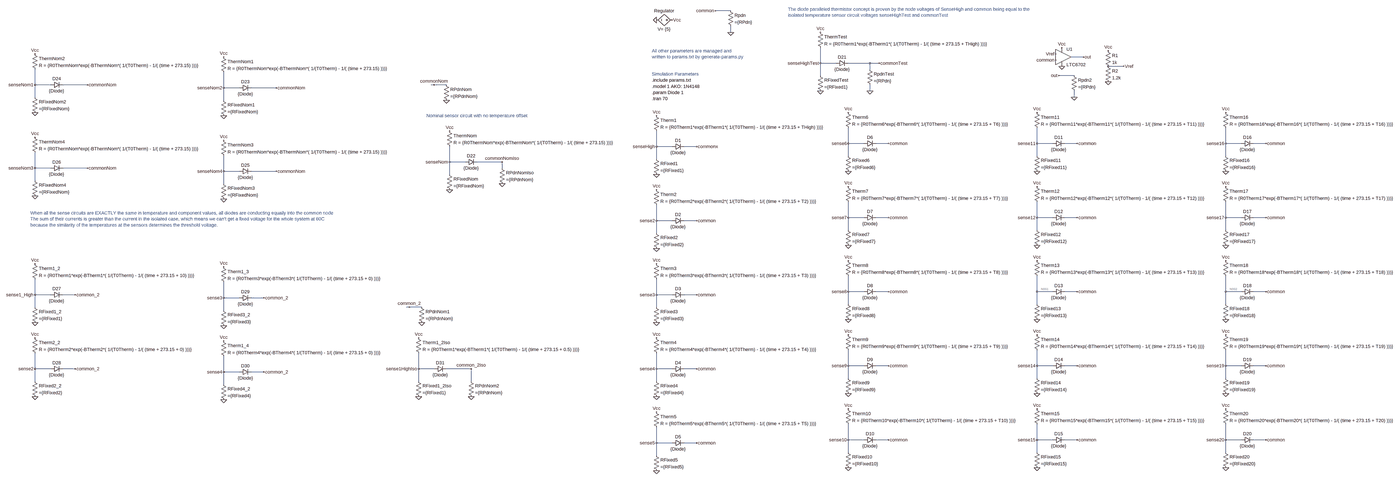
[diagram p0: schematic thermistor.asc, whole sheet]
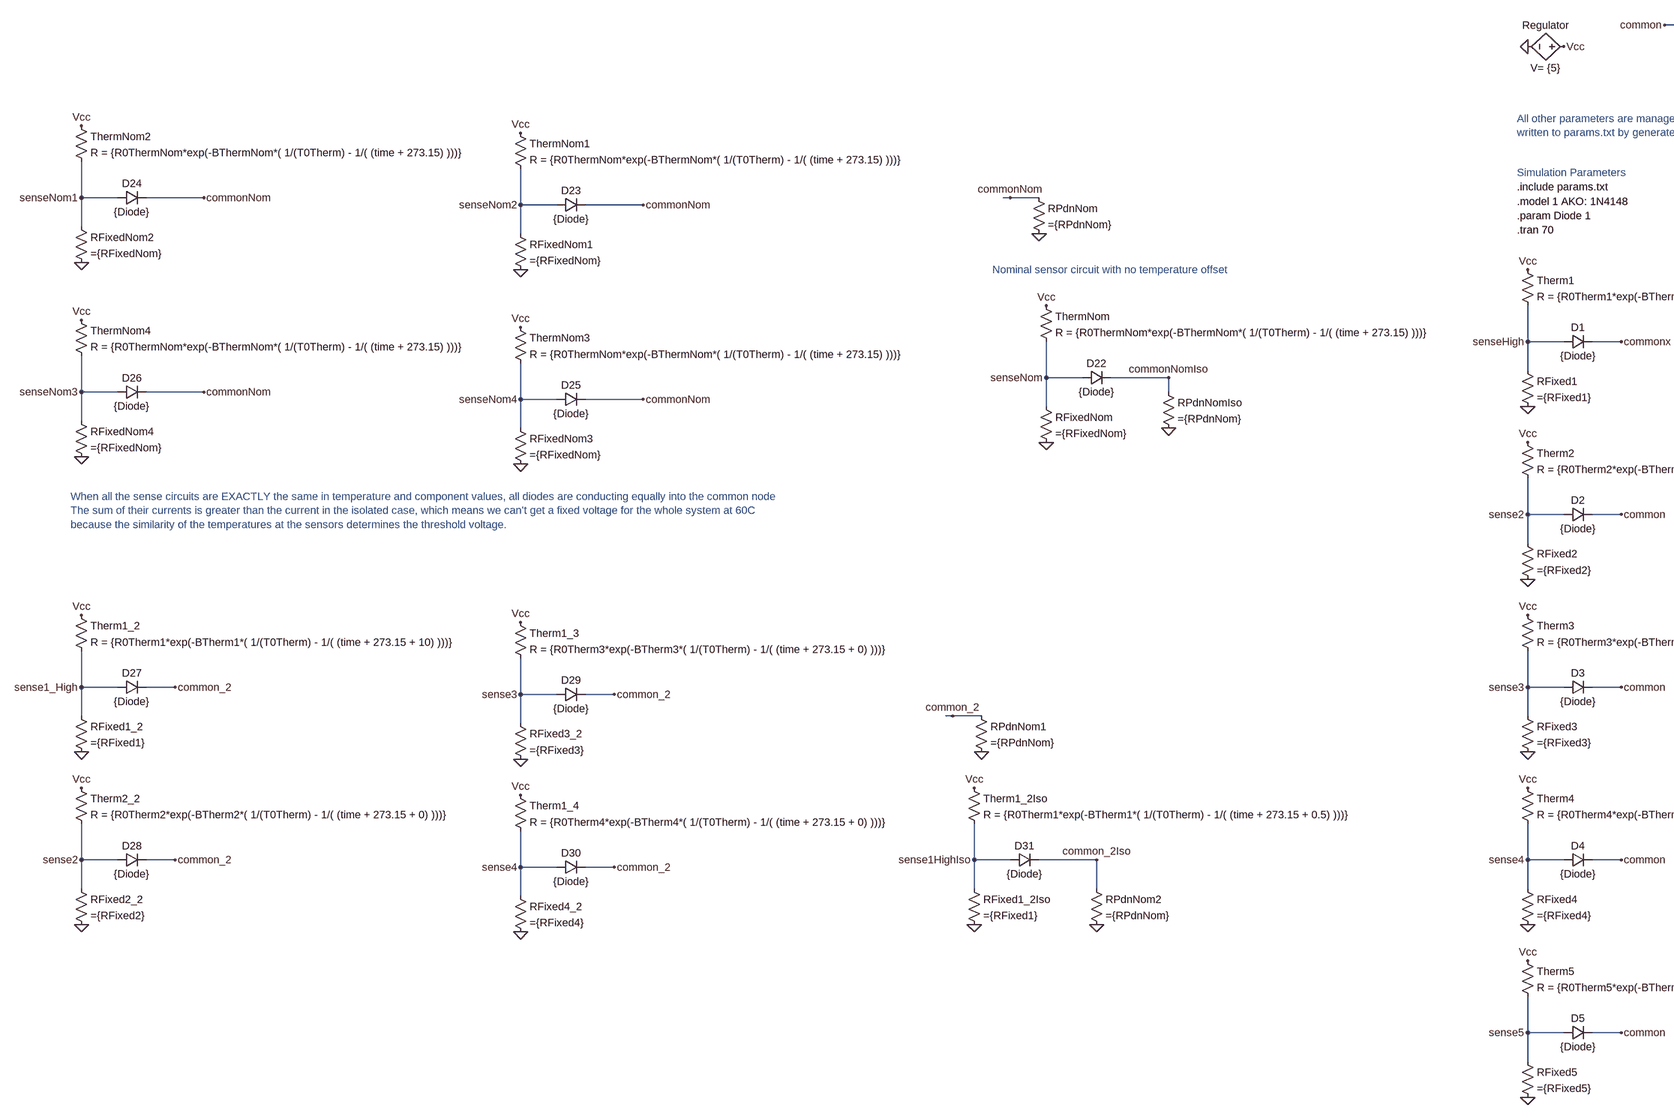
[diagram p1: schematic thermistor.asc, part, row 1 of 1, column 1 of 2]
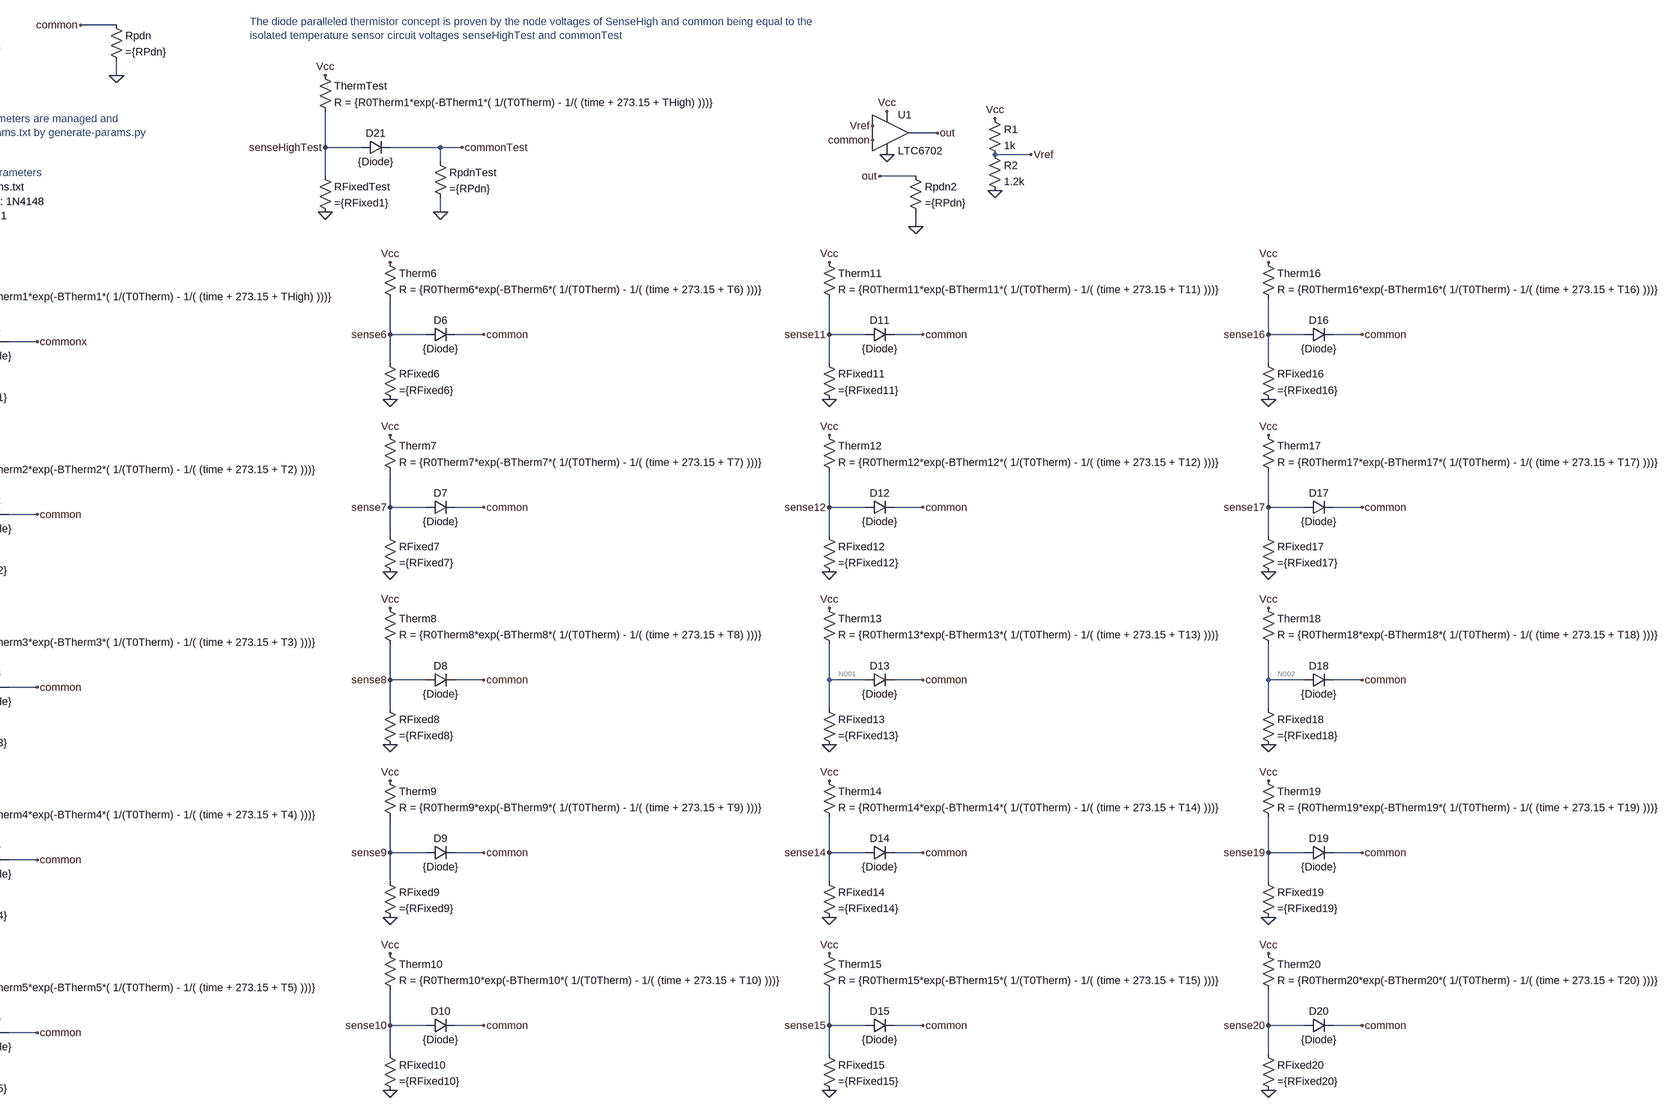
[diagram p2: schematic thermistor.asc, part, row 1 of 1, column 2 of 2]
thermistor.asc, the LTspice schematic file:
Version 4
SHEET 1 4100 2260
WIRE 560 -528 480 -528
WIRE 560 -416 560 -448
WIRE 2384 -288 2320 -288
WIRE 1024 -256 1024 -336
WIRE 1104 -256 1024 -256
WIRE 1280 -256 1168 -256
WIRE 1328 -256 1280 -256
WIRE 2592 -240 2512 -240
WIRE 1280 -224 1280 -256
WIRE 1024 -192 1024 -256
WIRE 2336 -192 2256 -192
WIRE -5088 -144 -5088 -224
WIRE -5008 -144 -5088 -144
WIRE -4816 -144 -4944 -144
WIRE -3024 -144 -3040 -144
WIRE -2960 -144 -3024 -144
WIRE -4112 -128 -4112 -208
WIRE -4032 -128 -4112 -128
WIRE -3840 -128 -3968 -128
WIRE 1280 -112 1280 -144
WIRE -5088 -80 -5088 -144
WIRE 2336 -80 2336 -112
WIRE -4112 -64 -4112 -128
WIRE 1168 160 1168 80
WIRE 1248 160 1168 160
WIRE 1376 160 1312 160
WIRE 2144 160 2144 80
WIRE 2224 160 2144 160
WIRE 2352 160 2288 160
WIRE 3120 160 3120 80
WIRE 3200 160 3120 160
WIRE 3328 160 3264 160
WIRE 176 176 176 96
WIRE 256 176 176 176
WIRE 384 176 320 176
WIRE 1168 224 1168 160
WIRE 2144 224 2144 160
WIRE 3120 224 3120 160
WIRE 176 240 176 176
WIRE -2944 256 -2944 176
WIRE -2864 256 -2944 256
WIRE -2672 256 -2800 256
WIRE -5088 288 -5088 208
WIRE -5008 288 -5088 288
WIRE -4816 288 -4944 288
WIRE -2672 288 -2672 256
WIRE -4112 304 -4112 224
WIRE -4032 304 -4112 304
WIRE -3840 304 -3968 304
WIRE -2944 320 -2944 256
WIRE -5088 352 -5088 288
WIRE -4112 368 -4112 304
WIRE 1168 544 1168 464
WIRE 1248 544 1168 544
WIRE 1376 544 1312 544
WIRE 2144 544 2144 464
WIRE 2224 544 2144 544
WIRE 2352 544 2288 544
WIRE 3120 544 3120 464
WIRE 3200 544 3120 544
WIRE 3328 544 3264 544
WIRE 176 560 176 480
WIRE 256 560 176 560
WIRE 384 560 320 560
WIRE 1168 608 1168 544
WIRE 2144 608 2144 544
WIRE 3120 608 3120 544
WIRE 176 624 176 560
WIRE 1168 928 1168 848
WIRE 1248 928 1168 928
WIRE 1376 928 1312 928
WIRE 2144 928 2144 848
WIRE 2224 928 2144 928
WIRE 2352 928 2288 928
WIRE 3120 928 3120 848
WIRE 3200 928 3120 928
WIRE 3328 928 3264 928
WIRE -5088 944 -5088 864
WIRE -5008 944 -5088 944
WIRE -4880 944 -4944 944
WIRE 176 944 176 864
WIRE 256 944 176 944
WIRE 384 944 320 944
WIRE -4112 960 -4112 880
WIRE -4032 960 -4112 960
WIRE -3904 960 -3968 960
WIRE 1168 992 1168 928
WIRE 2144 992 2144 928
WIRE 3120 992 3120 928
WIRE -5088 1008 -5088 944
WIRE -3152 1008 -3168 1008
WIRE -3088 1008 -3152 1008
WIRE 176 1008 176 944
WIRE -4112 1024 -4112 960
WIRE 1168 1312 1168 1232
WIRE 1248 1312 1168 1312
WIRE 1376 1312 1312 1312
WIRE 2144 1312 2144 1232
WIRE 2224 1312 2144 1312
WIRE 2352 1312 2288 1312
WIRE 3120 1312 3120 1232
WIRE 3200 1312 3120 1312
WIRE 3328 1312 3264 1312
WIRE -5088 1328 -5088 1248
WIRE -5008 1328 -5088 1328
WIRE -4880 1328 -4944 1328
WIRE -3104 1328 -3104 1248
WIRE -3024 1328 -3104 1328
WIRE -2832 1328 -2960 1328
WIRE 176 1328 176 1248
WIRE 256 1328 176 1328
WIRE 384 1328 320 1328
WIRE -4112 1344 -4112 1264
WIRE -4032 1344 -4112 1344
WIRE -3904 1344 -3968 1344
WIRE 1168 1376 1168 1312
WIRE 2144 1376 2144 1312
WIRE 3120 1376 3120 1312
WIRE -5088 1392 -5088 1328
WIRE -3104 1392 -3104 1328
WIRE -2832 1392 -2832 1328
WIRE 176 1392 176 1328
WIRE -4112 1408 -4112 1344
WIRE 1168 1696 1168 1616
WIRE 1248 1696 1168 1696
WIRE 1376 1696 1312 1696
WIRE 2144 1696 2144 1616
WIRE 2224 1696 2144 1696
WIRE 2352 1696 2288 1696
WIRE 3120 1696 3120 1616
WIRE 3200 1696 3120 1696
WIRE 3328 1696 3264 1696
WIRE 176 1712 176 1632
WIRE 256 1712 176 1712
WIRE 384 1712 320 1712
WIRE 1168 1760 1168 1696
WIRE 2144 1760 2144 1696
WIRE 3120 1760 3120 1696
WIRE 176 1776 176 1712
FLAG 176 320 0
FLAG 176 16 Vcc
FLAG 256 -480 Vcc
FLAG 384 176 commonx
FLAG 560 -416 0
FLAG 480 -528 common
FLAG 176 704 0
FLAG 176 400 Vcc
FLAG 384 560 common
FLAG 176 1088 0
FLAG 176 784 Vcc
FLAG 384 944 common
FLAG 176 -480 0
FLAG 176 1472 0
FLAG 176 1168 Vcc
FLAG 384 1328 common
FLAG 176 1856 0
FLAG 176 1552 Vcc
FLAG 384 1712 common
FLAG 1168 304 0
FLAG 1168 0 Vcc
FLAG 1376 160 common
FLAG 1168 688 0
FLAG 1168 384 Vcc
FLAG 1376 544 common
FLAG 1168 1072 0
FLAG 1168 768 Vcc
FLAG 1376 928 common
FLAG 1168 1456 0
FLAG 1168 1152 Vcc
FLAG 1376 1312 common
FLAG 1168 1840 0
FLAG 1168 1536 Vcc
FLAG 1376 1696 common
FLAG 2144 304 0
FLAG 2144 0 Vcc
FLAG 2352 160 common
FLAG 2144 688 0
FLAG 2144 384 Vcc
FLAG 2352 544 common
FLAG 2144 1072 0
FLAG 2144 768 Vcc
FLAG 2352 928 common
FLAG 2144 1456 0
FLAG 2144 1152 Vcc
FLAG 2352 1312 common
FLAG 2144 1840 0
FLAG 2144 1536 Vcc
FLAG 2352 1696 common
FLAG 3120 304 0
FLAG 3120 0 Vcc
FLAG 3328 160 common
FLAG 3120 688 0
FLAG 3120 384 Vcc
FLAG 3328 544 common
FLAG 3120 1072 0
FLAG 3120 768 Vcc
FLAG 3328 928 common
FLAG 3120 1456 0
FLAG 3120 1152 Vcc
FLAG 3328 1312 common
FLAG 3120 1840 0
FLAG 3120 1536 Vcc
FLAG 3328 1696 common
FLAG 176 176 senseHigh
FLAG 1168 160 sense6
FLAG 2144 160 sense11
FLAG 3120 160 sense16
FLAG 3120 544 sense17
FLAG 2144 544 sense12
FLAG 2144 1312 sense14
FLAG 3120 1312 sense19
FLAG 2144 1696 sense15
FLAG 3120 1696 sense20
FLAG 1168 1696 sense10
FLAG 176 1712 sense5
FLAG 1168 1312 sense9
FLAG 1168 928 sense8
FLAG 176 1328 sense4
FLAG 176 944 sense3
FLAG 1168 544 sense7
FLAG 176 560 sense2
FLAG 1024 -112 0
FLAG 1024 -416 Vcc
FLAG 1328 -256 commonTest
FLAG 1024 -256 senseHighTest
FLAG 1280 -112 0
FLAG 2592 -240 Vref
FLAG 2272 -240 0
FLAG 2272 -336 Vcc
FLAG 2240 -304 Vref
FLAG 2240 -272 common
FLAG 2384 -288 out
FLAG 2512 -160 0
FLAG 2512 -320 Vcc
FLAG 2336 -80 0
FLAG 2256 -192 out
FLAG -2944 400 0
FLAG -2944 96 Vcc
FLAG -2672 256 commonNomIso
FLAG -2944 256 senseNom
FLAG -2672 368 0
FLAG -4112 16 0
FLAG -4112 -288 Vcc
FLAG -3840 -128 commonNom
FLAG -4112 -128 senseNom2
FLAG -5088 0 0
FLAG -5088 -304 Vcc
FLAG -4816 -144 commonNom
FLAG -5088 -144 senseNom1
FLAG -4112 448 0
FLAG -4112 144 Vcc
FLAG -3024 -144 commonNom
FLAG -4112 304 senseNom4
FLAG -5088 432 0
FLAG -5088 128 Vcc
FLAG -4816 288 commonNom
FLAG -5088 288 senseNom3
FLAG -2960 -64 0
FLAG -3840 304 commonNom
FLAG -5088 1088 0
FLAG -5088 784 Vcc
FLAG -4880 944 common_2
FLAG -5088 1472 0
FLAG -5088 1168 Vcc
FLAG -4880 1328 common_2
FLAG -4112 1104 0
FLAG -4112 800 Vcc
FLAG -3904 960 common_2
FLAG -4112 1488 0
FLAG -4112 1184 Vcc
FLAG -3904 1344 common_2
FLAG -5088 944 sense1_High
FLAG -4112 1344 sense4
FLAG -4112 960 sense3
FLAG -5088 1328 sense2
FLAG -3152 1008 common_2
FLAG -3088 1088 0
FLAG -3104 1472 0
FLAG -3104 1168 Vcc
FLAG -2832 1328 common_2Iso
FLAG -3104 1328 sense1HighIso
FLAG -2832 1472 0
SYMBOL res 160 224 R0
SYMATTR InstName RFixed1
SYMATTR Value ={RFixed1}
SYMBOL res 160 0 R0
SYMATTR InstName Therm1
SYMATTR Value R = {R0Therm1*exp(-BTherm1*( 1/(T0Therm) - 1/( (time + 273.15 + THigh) )))}
SYMBOL diode 256 192 R270
WINDOW 0 32 32 VTop 2
WINDOW 3 0 32 VBottom 2
SYMATTR InstName D1
SYMATTR Value {Diode}
SYMBOL res 544 -544 R0
SYMATTR InstName Rpdn
SYMATTR Value ={RPdn}
SYMBOL res 160 608 R0
SYMATTR InstName RFixed2
SYMATTR Value ={RFixed2}
SYMBOL res 160 384 R0
SYMATTR InstName Therm2
SYMATTR Value R = {R0Therm2*exp(-BTherm2*( 1/(T0Therm) - 1/( (time + 273.15 + T2) )))}
SYMBOL diode 256 576 R270
WINDOW 0 32 32 VTop 2
WINDOW 3 0 32 VBottom 2
SYMATTR InstName D2
SYMATTR Value {Diode}
SYMBOL res 160 992 R0
SYMATTR InstName RFixed3
SYMATTR Value ={RFixed3}
SYMBOL res 160 768 R0
SYMATTR InstName Therm3
SYMATTR Value R = {R0Therm3*exp(-BTherm3*( 1/(T0Therm) - 1/( (time + 273.15 + T3) )))}
SYMBOL diode 256 960 R270
WINDOW 0 32 32 VTop 2
WINDOW 3 0 32 VBottom 2
SYMATTR InstName D3
SYMATTR Value {Diode}
SYMBOL bv 272 -480 M270
WINDOW 0 32 56 VTop 2
WINDOW 3 -32 56 VBottom 2
SYMATTR InstName Regulator
SYMATTR Value V= {5}
SYMBOL res 160 1376 R0
SYMATTR InstName RFixed4
SYMATTR Value ={RFixed4}
SYMBOL res 160 1152 R0
SYMATTR InstName Therm4
SYMATTR Value R = {R0Therm4*exp(-BTherm4*( 1/(T0Therm) - 1/( (time + 273.15 + T4) )))}
SYMBOL diode 256 1344 R270
WINDOW 0 32 32 VTop 2
WINDOW 3 0 32 VBottom 2
SYMATTR InstName D4
SYMATTR Value {Diode}
SYMBOL res 160 1760 R0
SYMATTR InstName RFixed5
SYMATTR Value ={RFixed5}
SYMBOL res 160 1536 R0
SYMATTR InstName Therm5
SYMATTR Value R = {R0Therm5*exp(-BTherm5*( 1/(T0Therm) - 1/( (time + 273.15 + T5) )))}
SYMBOL diode 256 1728 R270
WINDOW 0 32 32 VTop 2
WINDOW 3 0 32 VBottom 2
SYMATTR InstName D5
SYMATTR Value {Diode}
SYMBOL res 1152 208 R0
SYMATTR InstName RFixed6
SYMATTR Value ={RFixed6}
SYMBOL res 1152 -16 R0
SYMATTR InstName Therm6
SYMATTR Value R = {R0Therm6*exp(-BTherm6*( 1/(T0Therm) - 1/( (time + 273.15 + T6) )))}
SYMBOL diode 1248 176 R270
WINDOW 0 32 32 VTop 2
WINDOW 3 0 32 VBottom 2
SYMATTR InstName D6
SYMATTR Value {Diode}
SYMBOL res 1152 592 R0
SYMATTR InstName RFixed7
SYMATTR Value ={RFixed7}
SYMBOL res 1152 368 R0
SYMATTR InstName Therm7
SYMATTR Value R = {R0Therm7*exp(-BTherm7*( 1/(T0Therm) - 1/( (time + 273.15 + T7) )))}
SYMBOL diode 1248 560 R270
WINDOW 0 32 32 VTop 2
WINDOW 3 0 32 VBottom 2
SYMATTR InstName D7
SYMATTR Value {Diode}
SYMBOL res 1152 976 R0
SYMATTR InstName RFixed8
SYMATTR Value ={RFixed8}
SYMBOL res 1152 752 R0
SYMATTR InstName Therm8
SYMATTR Value R = {R0Therm8*exp(-BTherm8*( 1/(T0Therm) - 1/( (time + 273.15 + T8) )))}
SYMBOL diode 1248 944 R270
WINDOW 0 32 32 VTop 2
WINDOW 3 0 32 VBottom 2
SYMATTR InstName D8
SYMATTR Value {Diode}
SYMBOL res 1152 1360 R0
SYMATTR InstName RFixed9
SYMATTR Value ={RFixed9}
SYMBOL res 1152 1136 R0
SYMATTR InstName Therm9
SYMATTR Value R = {R0Therm9*exp(-BTherm9*( 1/(T0Therm) - 1/( (time + 273.15 + T9) )))}
SYMBOL diode 1248 1328 R270
WINDOW 0 32 32 VTop 2
WINDOW 3 0 32 VBottom 2
SYMATTR InstName D9
SYMATTR Value {Diode}
SYMBOL res 1152 1744 R0
SYMATTR InstName RFixed10
SYMATTR Value ={RFixed10}
SYMBOL res 1152 1520 R0
SYMATTR InstName Therm10
SYMATTR Value R = {R0Therm10*exp(-BTherm10*( 1/(T0Therm) - 1/( (time + 273.15 + T10) )))}
SYMBOL diode 1248 1712 R270
WINDOW 0 32 32 VTop 2
WINDOW 3 0 32 VBottom 2
SYMATTR InstName D10
SYMATTR Value {Diode}
SYMBOL res 2128 208 R0
SYMATTR InstName RFixed11
SYMATTR Value ={RFixed11}
SYMBOL res 2128 -16 R0
SYMATTR InstName Therm11
SYMATTR Value R = {R0Therm11*exp(-BTherm11*( 1/(T0Therm) - 1/( (time + 273.15 + T11) )))}
SYMBOL diode 2224 176 R270
WINDOW 0 32 32 VTop 2
WINDOW 3 0 32 VBottom 2
SYMATTR InstName D11
SYMATTR Value {Diode}
SYMBOL res 2128 592 R0
SYMATTR InstName RFixed12
SYMATTR Value ={RFixed12}
SYMBOL res 2128 368 R0
SYMATTR InstName Therm12
SYMATTR Value R = {R0Therm12*exp(-BTherm12*( 1/(T0Therm) - 1/( (time + 273.15 + T12) )))}
SYMBOL diode 2224 560 R270
WINDOW 0 32 32 VTop 2
WINDOW 3 0 32 VBottom 2
SYMATTR InstName D12
SYMATTR Value {Diode}
SYMBOL res 2128 976 R0
SYMATTR InstName RFixed13
SYMATTR Value ={RFixed13}
SYMBOL res 2128 752 R0
SYMATTR InstName Therm13
SYMATTR Value R = {R0Therm13*exp(-BTherm13*( 1/(T0Therm) - 1/( (time + 273.15 + T13) )))}
SYMBOL diode 2224 944 R270
WINDOW 0 32 32 VTop 2
WINDOW 3 0 32 VBottom 2
SYMATTR InstName D13
SYMATTR Value {Diode}
SYMBOL res 2128 1360 R0
SYMATTR InstName RFixed14
SYMATTR Value ={RFixed14}
SYMBOL res 2128 1136 R0
SYMATTR InstName Therm14
SYMATTR Value R = {R0Therm14*exp(-BTherm14*( 1/(T0Therm) - 1/( (time + 273.15 + T14) )))}
SYMBOL diode 2224 1328 R270
WINDOW 0 32 32 VTop 2
WINDOW 3 0 32 VBottom 2
SYMATTR InstName D14
SYMATTR Value {Diode}
SYMBOL res 2128 1744 R0
SYMATTR InstName RFixed15
SYMATTR Value ={RFixed15}
SYMBOL res 2128 1520 R0
SYMATTR InstName Therm15
SYMATTR Value R = {R0Therm15*exp(-BTherm15*( 1/(T0Therm) - 1/( (time + 273.15 + T15) )))}
SYMBOL diode 2224 1712 R270
WINDOW 0 32 32 VTop 2
WINDOW 3 0 32 VBottom 2
SYMATTR InstName D15
SYMATTR Value {Diode}
SYMBOL res 3104 208 R0
SYMATTR InstName RFixed16
SYMATTR Value ={RFixed16}
SYMBOL res 3104 -16 R0
SYMATTR InstName Therm16
SYMATTR Value R = {R0Therm16*exp(-BTherm16*( 1/(T0Therm) - 1/( (time + 273.15 + T16) )))}
SYMBOL diode 3200 176 R270
WINDOW 0 32 32 VTop 2
WINDOW 3 0 32 VBottom 2
SYMATTR InstName D16
SYMATTR Value {Diode}
SYMBOL res 3104 592 R0
SYMATTR InstName RFixed17
SYMATTR Value ={RFixed17}
SYMBOL res 3104 368 R0
SYMATTR InstName Therm17
SYMATTR Value R = {R0Therm17*exp(-BTherm17*( 1/(T0Therm) - 1/( (time + 273.15 + T17) )))}
SYMBOL diode 3200 560 R270
WINDOW 0 32 32 VTop 2
WINDOW 3 0 32 VBottom 2
SYMATTR InstName D17
SYMATTR Value {Diode}
SYMBOL res 3104 976 R0
SYMATTR InstName RFixed18
SYMATTR Value ={RFixed18}
SYMBOL res 3104 752 R0
SYMATTR InstName Therm18
SYMATTR Value R = {R0Therm18*exp(-BTherm18*( 1/(T0Therm) - 1/( (time + 273.15 + T18) )))}
SYMBOL diode 3200 944 R270
WINDOW 0 32 32 VTop 2
WINDOW 3 0 32 VBottom 2
SYMATTR InstName D18
SYMATTR Value {Diode}
SYMBOL res 3104 1360 R0
SYMATTR InstName RFixed19
SYMATTR Value ={RFixed19}
SYMBOL res 3104 1136 R0
SYMATTR InstName Therm19
SYMATTR Value R = {R0Therm19*exp(-BTherm19*( 1/(T0Therm) - 1/( (time + 273.15 + T19) )))}
SYMBOL diode 3200 1328 R270
WINDOW 0 32 32 VTop 2
WINDOW 3 0 32 VBottom 2
SYMATTR InstName D19
SYMATTR Value {Diode}
SYMBOL res 3104 1744 R0
SYMATTR InstName RFixed20
SYMATTR Value ={RFixed20}
SYMBOL res 3104 1520 R0
SYMATTR InstName Therm20
SYMATTR Value R = {R0Therm20*exp(-BTherm20*( 1/(T0Therm) - 1/( (time + 273.15 + T20) )))}
SYMBOL diode 3200 1712 R270
WINDOW 0 32 32 VTop 2
WINDOW 3 0 32 VBottom 2
SYMATTR InstName D20
SYMATTR Value {Diode}
SYMBOL res 1008 -208 R0
SYMATTR InstName RFixedTest
SYMATTR Value ={RFixed1}
SYMBOL res 1008 -432 R0
SYMATTR InstName ThermTest
SYMATTR Value R = {R0Therm1*exp(-BTherm1*( 1/(T0Therm) - 1/( (time + 273.15 + THigh) )))}
SYMBOL diode 1104 -240 R270
WINDOW 0 32 32 VTop 2
WINDOW 3 0 32 VBottom 2
SYMATTR InstName D21
SYMATTR Value {Diode}
SYMBOL res 1264 -240 R0
SYMATTR InstName RpdnTest
SYMATTR Value ={RPdn}
SYMBOL Comparators\\LTC6702 2272 -288 R0
SYMATTR InstName U1
SYMBOL res 2496 -336 R0
SYMATTR InstName R1
SYMATTR Value 1k
SYMBOL res 2496 -256 R0
SYMATTR InstName R2
SYMATTR Value 1.2k
SYMBOL res 2320 -208 R0
SYMATTR InstName Rpdn2
SYMATTR Value ={RPdn}
SYMBOL res -2960 304 R0
SYMATTR InstName RFixedNom
SYMATTR Value ={RFixedNom}
SYMBOL res -2960 80 R0
SYMATTR InstName ThermNom
SYMATTR Value R = {R0ThermNom*exp(-BThermNom*( 1/(T0Therm) - 1/( (time + 273.15) )))}
SYMBOL diode -2864 272 R270
WINDOW 0 32 32 VTop 2
WINDOW 3 0 32 VBottom 2
SYMATTR InstName D22
SYMATTR Value {Diode}
SYMBOL res -2688 272 R0
SYMATTR InstName RPdnNomIso
SYMATTR Value ={RPdnNom}
SYMBOL res -4128 -80 R0
SYMATTR InstName RFixedNom1
SYMATTR Value ={RFixedNom}
SYMBOL res -4128 -304 R0
SYMATTR InstName ThermNom1
SYMATTR Value R = {R0ThermNom*exp(-BThermNom*( 1/(T0Therm) - 1/( (time + 273.15) )))}
SYMBOL diode -4032 -112 R270
WINDOW 0 32 32 VTop 2
WINDOW 3 0 32 VBottom 2
SYMATTR InstName D23
SYMATTR Value {Diode}
SYMBOL res -5104 -96 R0
SYMATTR InstName RFixedNom2
SYMATTR Value ={RFixedNom}
SYMBOL res -5104 -320 R0
SYMATTR InstName ThermNom2
SYMATTR Value R = {R0ThermNom*exp(-BThermNom*( 1/(T0Therm) - 1/( (time + 273.15) )))}
SYMBOL diode -5008 -128 R270
WINDOW 0 32 32 VTop 2
WINDOW 3 0 32 VBottom 2
SYMATTR InstName D24
SYMATTR Value {Diode}
SYMBOL res -4128 352 R0
SYMATTR InstName RFixedNom3
SYMATTR Value ={RFixedNom}
SYMBOL res -4128 128 R0
SYMATTR InstName ThermNom3
SYMATTR Value R = {R0ThermNom*exp(-BThermNom*( 1/(T0Therm) - 1/( (time + 273.15) )))}
SYMBOL diode -4032 320 R270
WINDOW 0 32 32 VTop 2
WINDOW 3 0 32 VBottom 2
SYMATTR InstName D25
SYMATTR Value {Diode}
SYMBOL res -5104 336 R0
SYMATTR InstName RFixedNom4
SYMATTR Value ={RFixedNom}
SYMBOL res -5104 112 R0
SYMATTR InstName ThermNom4
SYMATTR Value R = {R0ThermNom*exp(-BThermNom*( 1/(T0Therm) - 1/( (time + 273.15) )))}
SYMBOL diode -5008 304 R270
WINDOW 0 32 32 VTop 2
WINDOW 3 0 32 VBottom 2
SYMATTR InstName D26
SYMATTR Value {Diode}
SYMBOL res -2976 -160 R0
SYMATTR InstName RPdnNom
SYMATTR Value ={RPdnNom}
SYMBOL res -5104 992 R0
SYMATTR InstName RFixed1_2
SYMATTR Value ={RFixed1}
SYMBOL res -5104 768 R0
SYMATTR InstName Therm1_2
SYMATTR Value R = {R0Therm1*exp(-BTherm1*( 1/(T0Therm) - 1/( (time + 273.15 + 10) )))}
SYMBOL diode -5008 960 R270
WINDOW 0 32 32 VTop 2
WINDOW 3 0 32 VBottom 2
SYMATTR InstName D27
SYMATTR Value {Diode}
SYMBOL res -5104 1376 R0
SYMATTR InstName RFixed2_2
SYMATTR Value ={RFixed2}
SYMBOL res -5104 1152 R0
SYMATTR InstName Therm2_2
SYMATTR Value R = {R0Therm2*exp(-BTherm2*( 1/(T0Therm) - 1/( (time + 273.15 + 0) )))}
SYMBOL diode -5008 1344 R270
WINDOW 0 32 32 VTop 2
WINDOW 3 0 32 VBottom 2
SYMATTR InstName D28
SYMATTR Value {Diode}
SYMBOL res -4128 1008 R0
SYMATTR InstName RFixed3_2
SYMATTR Value ={RFixed3}
SYMBOL res -4128 784 R0
SYMATTR InstName Therm1_3
SYMATTR Value R = {R0Therm3*exp(-BTherm3*( 1/(T0Therm) - 1/( (time + 273.15 + 0) )))}
SYMBOL diode -4032 976 R270
WINDOW 0 32 32 VTop 2
WINDOW 3 0 32 VBottom 2
SYMATTR InstName D29
SYMATTR Value {Diode}
SYMBOL res -4128 1392 R0
SYMATTR InstName RFixed4_2
SYMATTR Value ={RFixed4}
SYMBOL res -4128 1168 R0
SYMATTR InstName Therm1_4
SYMATTR Value R = {R0Therm4*exp(-BTherm4*( 1/(T0Therm) - 1/( (time + 273.15 + 0) )))}
SYMBOL diode -4032 1360 R270
WINDOW 0 32 32 VTop 2
WINDOW 3 0 32 VBottom 2
SYMATTR InstName D30
SYMATTR Value {Diode}
SYMBOL res -3104 992 R0
SYMATTR InstName RPdnNom1
SYMATTR Value ={RPdnNom}
SYMBOL res -3120 1376 R0
SYMATTR InstName RFixed1_2Iso
SYMATTR Value ={RFixed1}
SYMBOL res -3120 1152 R0
SYMATTR InstName Therm1_2Iso
SYMATTR Value R = {R0Therm1*exp(-BTherm1*( 1/(T0Therm) - 1/( (time + 273.15 + 0.5) )))}
SYMBOL diode -3024 1344 R270
WINDOW 0 32 32 VTop 2
WINDOW 3 0 32 VBottom 2
SYMATTR InstName D31
SYMATTR Value {Diode}
SYMBOL res -2848 1376 R0
SYMATTR InstName RPdnNom2
SYMATTR Value ={RPdnNom}
TEXT 152 -72 Left 2 !.tran 70
TEXT 152 -200 Left 2 ;Simulation Parameters
TEXT 152 -168 Left 2 !.include params.txt
TEXT 152 -136 Left 2 !.model 1 AKO: 1N4148
TEXT 152 -104 Left 2 !.param Diode 1
TEXT 152 -320 Left 2 ;All other parameters are managed and \nwritten to params.txt by generate-params.py
TEXT 856 -536 Left 2 ;The diode paralleled thermistor concept is proven by the node voltages of SenseHigh and common being equal to the \nisolated temperature sensor circuit voltages senseHighTest and commonTest
TEXT -3064 16 Left 2 ;Nominal sensor circuit with no temperature offset
TEXT -5112 520 Left 2 ;When all the sense circuits are EXACTLY the same in temperature and component values, all diodes are conducting equally into the common node\nThe sum of their currents is greater than the current in the isolated case, which means we can't get a fixed voltage for the whole system at 60C\nbecause the similarity of the temperatures at the sensors determines the threshold voltage.

The netlist it stands for:
* thermistor.asc
RFixed1 senseHigh 0 ={RFixed1}
R§Therm1 Vcc senseHigh R = {R0Therm1*exp(-BTherm1*( 1/(T0Therm) - 1/( (time + 273.15 + THigh) )))}
D1 senseHigh commonx {Diode}
Rpdn common 0 ={RPdn}
RFixed2 sense2 0 ={RFixed2}
R§Therm2 Vcc sense2 R = {R0Therm2*exp(-BTherm2*( 1/(T0Therm) - 1/( (time + 273.15 + T2) )))}
D2 sense2 common {Diode}
RFixed3 sense3 0 ={RFixed3}
R§Therm3 Vcc sense3 R = {R0Therm3*exp(-BTherm3*( 1/(T0Therm) - 1/( (time + 273.15 + T3) )))}
D3 sense3 common {Diode}
B§Regulator Vcc 0 V= {5}
RFixed4 sense4 0 ={RFixed4}
R§Therm4 Vcc sense4 R = {R0Therm4*exp(-BTherm4*( 1/(T0Therm) - 1/( (time + 273.15 + T4) )))}
D4 sense4 common {Diode}
RFixed5 sense5 0 ={RFixed5}
R§Therm5 Vcc sense5 R = {R0Therm5*exp(-BTherm5*( 1/(T0Therm) - 1/( (time + 273.15 + T5) )))}
D5 sense5 common {Diode}
RFixed6 sense6 0 ={RFixed6}
R§Therm6 Vcc sense6 R = {R0Therm6*exp(-BTherm6*( 1/(T0Therm) - 1/( (time + 273.15 + T6) )))}
D6 sense6 common {Diode}
RFixed7 sense7 0 ={RFixed7}
R§Therm7 Vcc sense7 R = {R0Therm7*exp(-BTherm7*( 1/(T0Therm) - 1/( (time + 273.15 + T7) )))}
D7 sense7 common {Diode}
RFixed8 sense8 0 ={RFixed8}
R§Therm8 Vcc sense8 R = {R0Therm8*exp(-BTherm8*( 1/(T0Therm) - 1/( (time + 273.15 + T8) )))}
D8 sense8 common {Diode}
RFixed9 sense9 0 ={RFixed9}
R§Therm9 Vcc sense9 R = {R0Therm9*exp(-BTherm9*( 1/(T0Therm) - 1/( (time + 273.15 + T9) )))}
D9 sense9 common {Diode}
RFixed10 sense10 0 ={RFixed10}
R§Therm10 Vcc sense10 R = {R0Therm10*exp(-BTherm10*( 1/(T0Therm) - 1/( (time + 273.15 + T10) )))}
D10 sense10 common {Diode}
RFixed11 sense11 0 ={RFixed11}
R§Therm11 Vcc sense11 R = {R0Therm11*exp(-BTherm11*( 1/(T0Therm) - 1/( (time + 273.15 + T11) )))}
D11 sense11 common {Diode}
RFixed12 sense12 0 ={RFixed12}
R§Therm12 Vcc sense12 R = {R0Therm12*exp(-BTherm12*( 1/(T0Therm) - 1/( (time + 273.15 + T12) )))}
D12 sense12 common {Diode}
RFixed13 N001 0 ={RFixed13}
R§Therm13 Vcc N001 R = {R0Therm13*exp(-BTherm13*( 1/(T0Therm) - 1/( (time + 273.15 + T13) )))}
D13 N001 common {Diode}
RFixed14 sense14 0 ={RFixed14}
R§Therm14 Vcc sense14 R = {R0Therm14*exp(-BTherm14*( 1/(T0Therm) - 1/( (time + 273.15 + T14) )))}
D14 sense14 common {Diode}
RFixed15 sense15 0 ={RFixed15}
R§Therm15 Vcc sense15 R = {R0Therm15*exp(-BTherm15*( 1/(T0Therm) - 1/( (time + 273.15 + T15) )))}
D15 sense15 common {Diode}
RFixed16 sense16 0 ={RFixed16}
R§Therm16 Vcc sense16 R = {R0Therm16*exp(-BTherm16*( 1/(T0Therm) - 1/( (time + 273.15 + T16) )))}
D16 sense16 common {Diode}
RFixed17 sense17 0 ={RFixed17}
R§Therm17 Vcc sense17 R = {R0Therm17*exp(-BTherm17*( 1/(T0Therm) - 1/( (time + 273.15 + T17) )))}
D17 sense17 common {Diode}
RFixed18 N002 0 ={RFixed18}
R§Therm18 Vcc N002 R = {R0Therm18*exp(-BTherm18*( 1/(T0Therm) - 1/( (time + 273.15 + T18) )))}
D18 N002 common {Diode}
RFixed19 sense19 0 ={RFixed19}
R§Therm19 Vcc sense19 R = {R0Therm19*exp(-BTherm19*( 1/(T0Therm) - 1/( (time + 273.15 + T19) )))}
D19 sense19 common {Diode}
RFixed20 sense20 0 ={RFixed20}
R§Therm20 Vcc sense20 R = {R0Therm20*exp(-BTherm20*( 1/(T0Therm) - 1/( (time + 273.15 + T20) )))}
D20 sense20 common {Diode}
RFixedTest senseHighTest 0 ={RFixed1}
R§ThermTest Vcc senseHighTest R = {R0Therm1*exp(-BTherm1*( 1/(T0Therm) - 1/( (time + 273.15 + THigh) )))}
D21 senseHighTest commonTest {Diode}
RpdnTest commonTest 0 ={RPdn}
XU1 common Vref Vcc 0 out LTC6702
R1 Vcc Vref 1k
R2 Vref 0 1.2k
Rpdn2 out 0 ={RPdn}
RFixedNom senseNom 0 ={RFixedNom}
R§ThermNom Vcc senseNom R = {R0ThermNom*exp(-BThermNom*( 1/(T0Therm) - 1/( (time + 273.15) )))}
D22 senseNom commonNomIso {Diode}
RPdnNomIso commonNomIso 0 ={RPdnNom}
RFixedNom1 senseNom2 0 ={RFixedNom}
R§ThermNom1 Vcc senseNom2 R = {R0ThermNom*exp(-BThermNom*( 1/(T0Therm) - 1/( (time + 273.15) )))}
D23 senseNom2 commonNom {Diode}
RFixedNom2 senseNom1 0 ={RFixedNom}
R§ThermNom2 Vcc senseNom1 R = {R0ThermNom*exp(-BThermNom*( 1/(T0Therm) - 1/( (time + 273.15) )))}
D24 senseNom1 commonNom {Diode}
RFixedNom3 senseNom4 0 ={RFixedNom}
R§ThermNom3 Vcc senseNom4 R = {R0ThermNom*exp(-BThermNom*( 1/(T0Therm) - 1/( (time + 273.15) )))}
D25 senseNom4 commonNom {Diode}
RFixedNom4 senseNom3 0 ={RFixedNom}
R§ThermNom4 Vcc senseNom3 R = {R0ThermNom*exp(-BThermNom*( 1/(T0Therm) - 1/( (time + 273.15) )))}
D26 senseNom3 commonNom {Diode}
RPdnNom commonNom 0 ={RPdnNom}
RFixed1_2 sense1_High 0 ={RFixed1}
R§Therm1_2 Vcc sense1_High R = {R0Therm1*exp(-BTherm1*( 1/(T0Therm) - 1/( (time + 273.15 + 10) )))}
D27 sense1_High common_2 {Diode}
RFixed2_2 sense2 0 ={RFixed2}
R§Therm2_2 Vcc sense2 R = {R0Therm2*exp(-BTherm2*( 1/(T0Therm) - 1/( (time + 273.15 + 0) )))}
D28 sense2 common_2 {Diode}
RFixed3_2 sense3 0 ={RFixed3}
R§Therm1_3 Vcc sense3 R = {R0Therm3*exp(-BTherm3*( 1/(T0Therm) - 1/( (time + 273.15 + 0) )))}
D29 sense3 common_2 {Diode}
RFixed4_2 sense4 0 ={RFixed4}
R§Therm1_4 Vcc sense4 R = {R0Therm4*exp(-BTherm4*( 1/(T0Therm) - 1/( (time + 273.15 + 0) )))}
D30 sense4 common_2 {Diode}
RPdnNom1 common_2 0 ={RPdnNom}
RFixed1_2Iso sense1HighIso 0 ={RFixed1}
R§Therm1_2Iso Vcc sense1HighIso R = {R0Therm1*exp(-BTherm1*( 1/(T0Therm) - 1/( (time + 273.15 + 0.5) )))}
D31 sense1HighIso common_2Iso {Diode}
RPdnNom2 common_2Iso 0 ={RPdnNom}
.model D D
.lib standard.dio
.tran 70
* Simulation Parameters
.include params.txt
.model 1 AKO: 1N4148
.param Diode 1
* All other parameters are managed and
* written to params.txt by generate-params.py
* The diode paralleled thermistor concept is proven by the node voltages of SenseHigh and common being equal to the
* isolated temperature sensor circuit voltages senseHighTest and commonTest
* Nominal sensor circuit with no temperature offset
* When all the sense circuits are EXACTLY the same in temperature and component values, all diodes are conducting equally into the common node
* The sum of their currents is greater than the current in the isolated case, which means we can't get a fixed voltage for the whole system at 60C
* because the similarity of the temperatures at the sensors determines the threshold voltage.
.lib LTC3.lib
.backanno
.end

* Results of the author's LTspice run, read from the files saved beside the schematic
* Operating Point, zero values left out:
*   V(sensehigh) = 312.2 mV
*   V(vcc) = 5 V
*   V(commonx) = 312.2 mV
*   V(common) = 24.19 mV
*   V(sense2) = 170.9 mV
*   V(sense3) = 214 mV
*   V(sense4) = 202.7 mV
*   V(sense5) = 164.8 mV
*   V(sense6) = 113.3 mV
*   V(sense7) = 240.4 mV
*   V(sense8) = 214.2 mV
*   V(sense9) = 249.4 mV
*   V(sense10) = 247.8 mV
*   V(sense11) = 181.5 mV
*   V(sense12) = 182.8 mV
*   V(n001) = 212.7 mV
*   V(sense14) = 155.4 mV
*   V(sense15) = 218.7 mV
*   V(sense16) = 199.9 mV
*   V(sense17) = 162.7 mV
*   V(n002) = 130.4 mV
*   V(sense19) = 173.7 mV
*   V(sense20) = 124 mV
*   V(sensehightest) = 310.7 mV
*   V(commontest) = 16.61 mV
*   V(vref) = 2.727 V
*   V(out) = 220.7 nV
*   V(sensenom) = 171 mV
*   V(commonnomiso) = 1.047 mV
*   V(sensenom2) = 171 mV
*   V(commonnom) = 3.923 mV
*   V(sensenom1) = 171 mV
*   V(sensenom4) = 171 mV
*   V(sensenom3) = 171 mV
*   V(sense1_high) = 255.9 mV
*   V(common_2) = 10.44 mV
*   V(sense1highiso) = 171.8 mV
*   V(common_2iso) = 1.064 mV
*   I(Therm1) = 313.4 µA
*   I(Therm2) = 170.2 µA
*   I(Therm3) = 256.5 µA
*   I(Regulator) = -8.358 mA
*   I(Therm4) = 234.2 µA
*   I(Therm5) = 165.5 µA
*   I(Therm6) = 113.7 µA
*   I(Therm7) = 241.4 µA
*   I(Therm8) = 216.1 µA
*   I(Therm9) = 250.1 µA
*   I(Therm10) = 246.3 µA
*   I(Therm11) = 180.8 µA
*   I(Therm12) = 181.4 µA
*   I(Therm13) = 211.3 µA
*   I(Therm14) = 155.6 µA
*   I(Therm15) = 220.3 µA
*   I(Therm16) = 201.7 µA
*   I(Therm17) = 163.7 µA
*   I(Therm18) = 131.3 µA
*   I(Therm19) = 172.3 µA
*   I(Therm20) = 124.6 µA
*   I(Thermtest) = 313.5 µA
*   I(Thermnom) = 171.1 µA
*   I(Thermnom1) = 171.1 µA
*   I(Thermnom2) = 171.1 µA
*   I(Thermnom3) = 171.1 µA
*   I(Thermnom4) = 171.1 µA
*   I(Therm1_2) = 257.4 µA
*   I(Therm2_2) = 174.3 µA
*   I(Therm1_3) = 168.7 µA
*   I(Therm1_4) = 168.8 µA
*   I(Therm1_2iso) = 172.5 µA
*   I(D2) = 61.69 nA
*   I(D3) = 163.6 nA
*   I(D4) = 127 nA
*   I(D5) = 53.63 nA
*   I(D6) = 15.47 nA
*   I(D7) = 295.3 nA
*   I(D8) = 164.4 nA
*   I(D9) = 360.5 nA
*   I(D10) = 347.9 nA
*   I(D11) = 78.63 nA
*   I(D12) = 80.86 nA
*   I(D13) = 159.1 nA
*   I(D14) = 43.07 nA
*   I(D15) = 181.6 nA
*   I(D16) = 119.2 nA
*   I(D17) = 51.03 nA
*   I(D18) = 23.74 nA
*   I(D19) = 65.77 nA
*   I(D20) = 20.3 nA
*   I(D21) = 1.657 µA
*   I(D22) = 104.7 nA
*   I(D23) = 98.09 nA
*   I(D24) = 98.09 nA
*   I(D25) = 98.09 nA
*   I(D26) = 98.09 nA
*   I(D27) = 564.5 nA
*   I(D28) = 84.44 nA
*   I(D29) = 222.4 nA
*   I(D30) = 172.9 nA
*   I(D31) = 106.4 nA
*   I(Rfixed1) = 313.4 µA
*   I(Rpdn) = 2.413 µA
*   I(Rfixed2) = 172.2 µA
*   I(Rfixed3) = 212.4 µA
*   I(Rfixed4) = 201.4 µA
*   I(Rfixed5) = 165.5 µA
*   I(Rfixed6) = 113.7 µA
*   I(Rfixed7) = 241.1 µA
*   I(Rfixed8) = 216 µA
*   I(Rfixed9) = 249.7 µA
*   I(Rfixed10) = 246 µA
*   I(Rfixed11) = 180.7 µA
*   I(Rfixed12) = 181.3 µA
*   I(Rfixed13) = 211.1 µA
*   I(Rfixed14) = 155.5 µA
*   I(Rfixed15) = 220.1 µA
*   I(Rfixed16) = 201.6 µA
*   I(Rfixed17) = 163.6 µA
*   I(Rfixed18) = 131.2 µA
*   I(Rfixed19) = 172.2 µA
*   I(Rfixed20) = 124.6 µA
*   I(Rfixedtest) = 311.9 µA
*   I(Rpdntest) = 1.657 µA
*   I(R1) = 2.273 mA
*   I(R2) = 2.273 mA
*   I(Rpdn2) = 22.02 pA
*   I(Rfixednom) = 171 µA
*   I(Rpdnnomiso) = 104.7 nA
*   I(Rfixednom1) = 171 µA
*   I(Rfixednom2) = 171 µA
*   I(Rfixednom3) = 171 µA
*   I(Rfixednom4) = 171 µA
*   I(Rpdnnom) = 392.3 nA
*   I(Rfixed1_2) = 256.9 µA
*   I(Rfixed2_2) = 172.2 µA
*   I(Rfixed3_2) = 212.4 µA
*   I(Rfixed4_2) = 201.4 µA
*   I(Rpdnnom1) = 1.044 µA
*   I(Rfixed1_2iso) = 172.4 µA
*   I(Rpdnnom2) = 106.4 nA
*   Ix(u1:1) = 2.419 pA
*   Ix(u1:2) = 20 pA
*   Ix(u1:3) = 24.07 µA
*   Ix(u1:4) = -24.07 µA
*   Ix(u1:5) = -17.02 pA
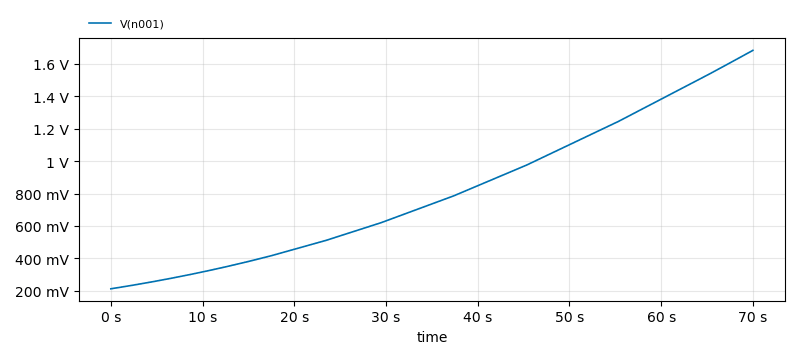
[diagram p3: Transient Analysis of thermistor.asc, plotted from the saved traces]
* Transient Analysis, 1 run:
*   V(n001): min 212.7 mV, max 1.683 V, average 809 mV, rms 920.9 mV, last 1.683 V